# EAGLE design HBridge (EAGLE 6.6.0)
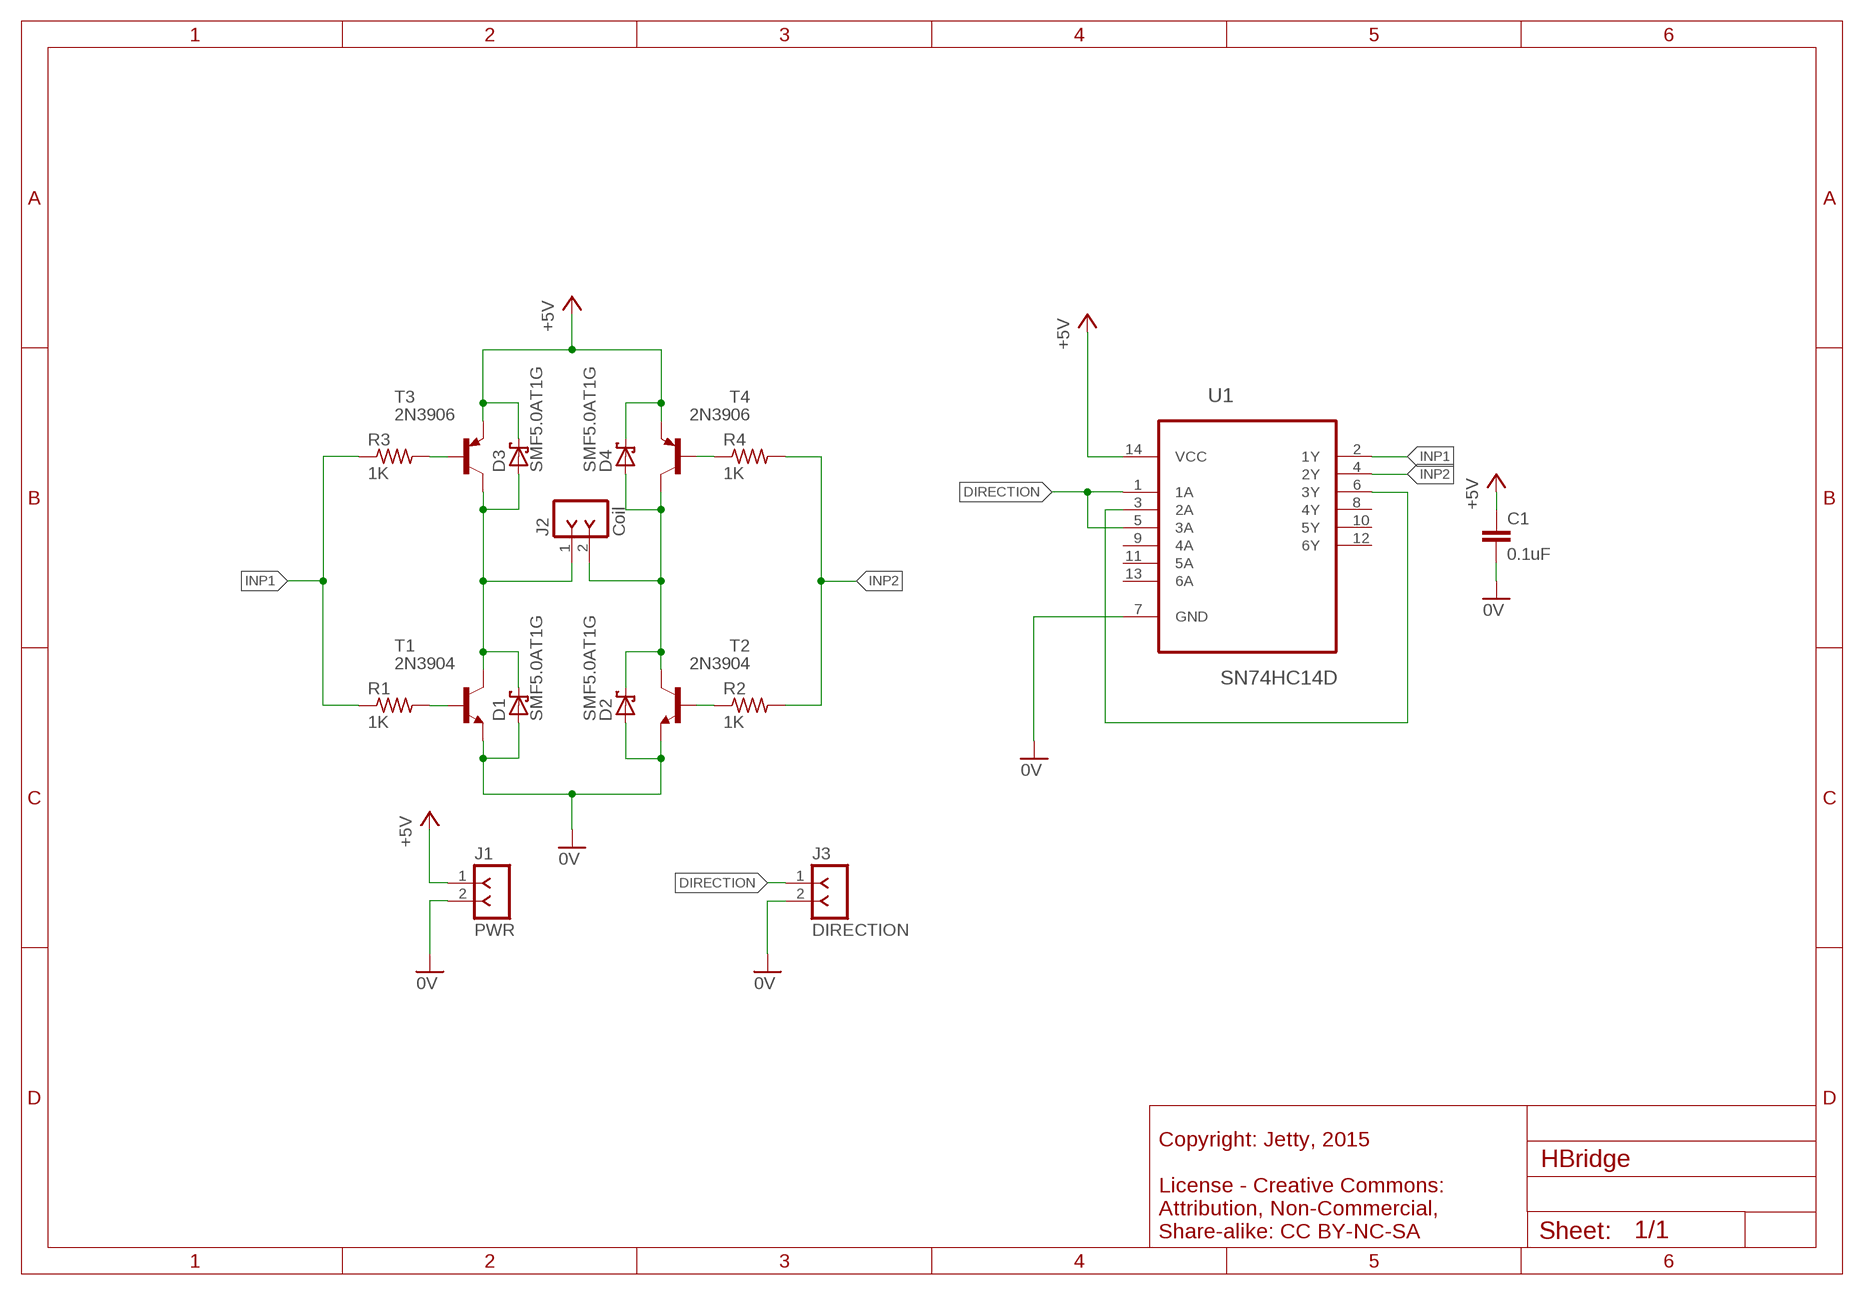
[diagram p0: schematic, sheet 1]

## Parts
C1  0.1uF  C-EUC0603  [C0603]
D1  SMF5.0AT1G  SMF5.0AT1  [SOD123FL]
D2  SMF5.0AT1G  SMF5.0AT1  [SOD123FL]
D3  SMF5.0AT1G  SMF5.0AT1  [SOD123FL]
D4  SMF5.0AT1G  SMF5.0AT1  [SOD123FL]
J1  PWR  F-1X02-SIP-100-32Y  [SIP-100-02-32Y]
J2  Coil  F-1X02-SIP-100-32Y  [SIP-100-02-32Y]
J3  DIRECTION  F-1X02-SIP-100-32Y  [SIP-100-02-32Y]
R1  1K  R-US_R0603  [R0603]
R2  1K  R-US_R0603  [R0603]
R3  1K  R-US_R0603  [R0603]
R4  1K  R-US_R0603  [R0603]
T1  2N3904  MMBT3904LT1-NPN-SOT23-BEC  [SOT23-BEC]
T2  2N3904  MMBT3904LT1-NPN-SOT23-BEC  [SOT23-BEC]
T3  2N3906  MMBT3906LT1-PNP-SOT23-BEC  [SOT23-BEC]
T4  2N3906  MMBT3906LT1-PNP-SOT23-BEC  [SOT23-BEC]
U1  SN74HC14D  [SOIC127P600X175-14N]

## Nets
0V: C1.2 D1.A D2.A J1.2 J3.2 T1.E T2.E U1.7(GND)
+5V: C1.1 D3.C D4.C J1.1 T3.E T4.E U1.14(VCC)
DIRECTION: J3.1 U1.1(1A) U1.5(3A)
INP1: R1.1 R3.1 U1.2(1Y)
INP2: R2.2 R4.2 U1.4(2Y)
N$1: R1.2 T1.B
N$2: R2.1 T2.B
N$3: R3.2 T3.B
N$4: R4.1 T4.B
N$6: D2.C D4.A J2.2 T2.C T4.C
N$7: D1.C D3.A J2.1 T1.C T3.C
N$10: U1.3(2A) U1.6(3Y)
Unconnected: U1.8(4Y) U1.9(4A) U1.10(5Y) U1.11(5A) U1.12(6Y) U1.13(6A)

## Notes on the sheet
- Copyright: Jetty, 2015
  
  License - Creative Commons:
  Attribution, Non-Commercial,
  Share-alike: CC BY-NC-SA

## Library data of the parts
C1 = rcl:C-EU: CAPACITOR, European symbol
D1-D4 = diode:SMF5.0AT1: 200 W Transient Voltage Suppressor Source: Data sheet <http://www.onsemi.com/pub_link/Collateral/SMF5.0AT1-D.PDF>
J1-J3 = con-headers-jp:F-1X02-: FEMALE HEADER
R1-R4 = rcl:R-US_: RESISTOR, American symbol
T1 T2 = transistor:*-NPN-: NPN Transistror BF959 corrected 2008.03.06
T3 T4 = transistor:*-PNP-: PNP Transistror
U1 = Texas Instruments_By_element14_Batch_1:SN74HC14D: HEX SCHMITT-TRIGGER INVERTERS; MPN: SN74HC14D; OC_FARNELL: 9594566; OC_NEWARK: 08F6449; PACKAGE: SOIC-14; SUPPLIER: Texas Instruments

## Board
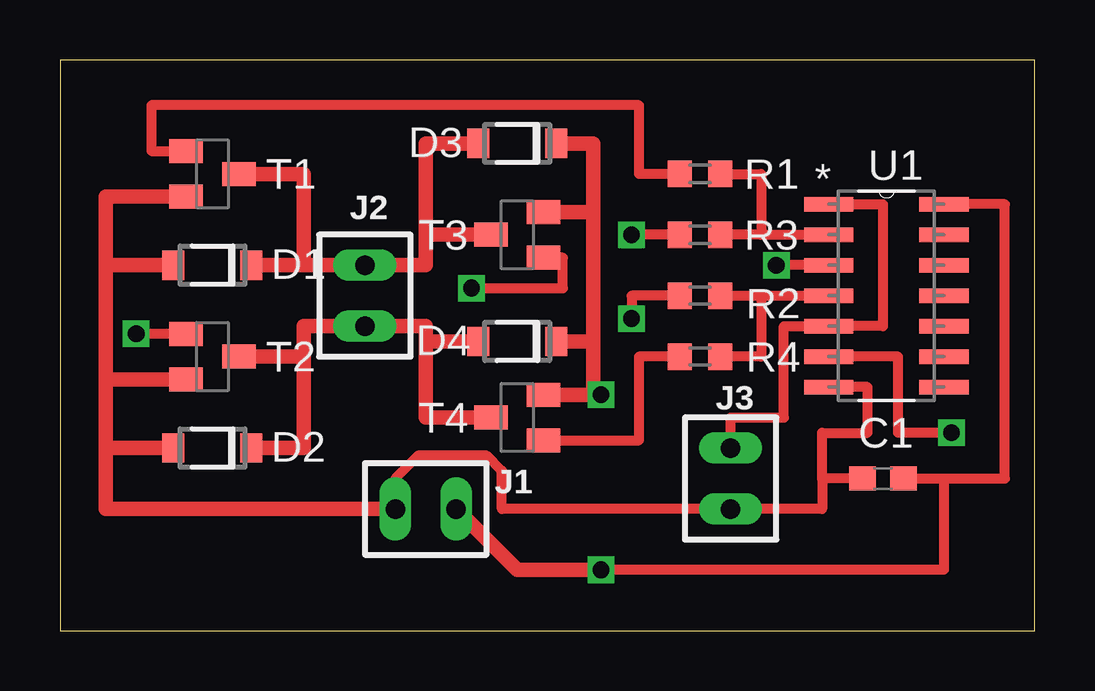
[diagram p1: board, top side]
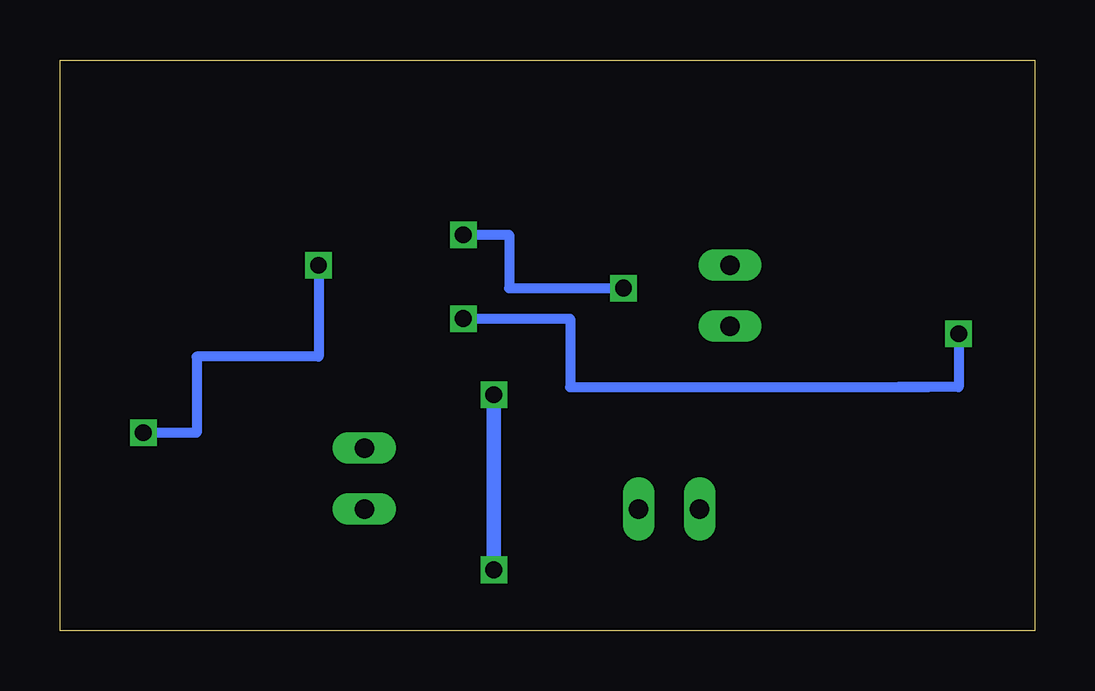
[diagram p2: board, bottom side, seen from below]

Size 40.62 x 23.8 mm. Coordinates in mm from the lower left corner, seen from the top.
Outline: 0,0 40.62,0 40.62,23.8 0,23.8 0,0
Copper layers (1*16): Top 0.035mm / dielectric 1.5mm / Bottom 0.035mm
Design rules "default": minimum track width 10mil, minimum drill 24mil, track to track 8mil, track to pad 8mil, pad to pad 8mil, via to via 8mil, smd to smd 8mil, copper to edge 40mil, drill to drill 8mil, minimum pad ring 10mil, minimum via ring 8mil, stop-mask expansion 4mil, vias tented up to drill 0mil, thermal gap 10mil

### Footprints (pad centres in the part's own frame; a part is rotated, then mirrored left to right if it is on the bottom)
C0603 = smd 1.1 x 1: 1 -0.85,0; 2 0.85,0
SOD123FL = smd 0.91 x 1.22: A 1.625,0; C -1.625,0
SIP-100-02-32Y = drill 0.813 long: 1 -1.27,0; 2 1.27,0
R0603 = smd 1 x 1.1: 1 -0.85,0; 2 0.85,0
SOT23-BEC = smd 1 x 1.4: B -0.95,-1.1; C 0,1.1; E 0.95,-1.1
SOIC127P600X175-14N = smd 2.057 x 0.61: 1 -4.801,7.62; 2 -4.801,6.35; 3 -4.801,5.08; 4 -4.801,3.81; 5 -4.801,2.54; 6 -4.801,1.27; 7 -4.801,0; 8 0,0; 9 0,1.27; 10 0,2.54; 11 0,3.81; 12 0,5.08; 13 0,6.35; 14 0,7.62

### Placement (x,y rotation side)
C1  34.29,6.35 180 top
D1  6.35,15.24 180 top
D2  6.35,7.62 180 top
D3  19.05,20.32 180 top
D4  19.05,12.06 180 top
J1  15.24,5.08 180 top
J2  12.7,13.97 270 top
J3  27.94,6.35 270 top
R1  26.67,19.05 180 top
R2  26.67,13.97 0 top
R3  26.67,16.51 180 top
R4  26.67,11.43 0 top
T1  6.35,19.05 270 top
T2  6.35,11.43 270 top
T3  19.05,16.51 90 top
T4  19.05,8.89 90 top
U1  36.83,10.16 0 top

### Tracks (layer width: path | path; a pad name or v marks a point on that pad's centre or on a via)
0V
  Top 0.406: C1.2 31.75,6.35 | 31.75,6.35 31.75,7.62 31.75,8.26 33.66,8.26 33.66,10.16 U1.7 | 31.75,6.35 31.75,5.08 J3.2 18.41,5.08 18.41,6.67 17.78,7.3 14.92,7.3 13.97,6.35 J1.2
  Top 0.61: 1.91,7.62 D2.A 1.91,7.62 | 1.91,7.62 1.91,9.84 | 1.91,9.84 1.91,10.48 | 1.91,10.48 T2.E | D1.A 1.91,15.24 | 1.91,15.24 1.91,17.78 1.91,18.1 T1.E | 1.91,15.24 1.91,10.48 | 1.91,10.48 1.91,9.84 | 1.91,7.62 1.91,5.08 J1.2
+5V  (via drill 0.7)
  Top 0.406: C1.1 36.83,6.35 | 36.83,6.35 39.37,6.35 39.37,17.78 U1.14 | C1.1 36.83,6.35 | C1.1 36.83,6.35 | 36.83,6.35 36.83,2.54 v22.54,2.54 19.05,2.54
  Top 0.61: D3.C 22.23,20.32 22.23,18.41 22.23,17.46 | T3.E 22.23,17.46 | D4.C 22.23,12.06 | 22.23,12.06 22.23,9.84 T4.E v22.54,9.84 | 22.23,17.46 22.23,12.06 | J1.1 19.05,2.54 v22.54,2.54
  Bottom 0.61: v22.54,9.84 v22.54,2.54
DIRECTION
  Top 0.406: J3.1 27.94,8.89 30.16,8.89 30.16,12.7 U1.5 34.29,12.7 34.29,17.78 U1.1
INP1
  Top 0.406: R1.1 29.21,19.05 29.21,16.51 | 29.21,16.51 R3.1 | 29.21,16.51 U1.2
INP2
  Top 0.406: R2.2 29.21,13.97 | 29.21,13.97 29.21,11.43 R4.2 | 29.21,13.97 U1.4
N$1
  Top 0.406: R1.2 24.13,19.05 24.13,21.91 3.81,21.91 3.81,20 T1.B
N$2  (via drill 0.7)
  Top 0.406: R2.1 23.81,13.97 v23.81,13.02 | T2.B v3.17,12.38
  Bottom 0.406: v23.81,13.02 19.37,13.02 19.37,10.16 5.71,10.16 | 5.71,10.16 4.45,10.16 | v3.17,12.38 3.17,10.16 5.71,10.16
N$3  (via drill 0.7)
  Top 0.406: R3.2 v23.81,16.51 | v17.14,14.29 20.95,14.29 20.95,15.56 T3.B
  Bottom 0.406: v23.81,16.51 22.86,16.51 21.91,16.51 21.91,14.29 v17.14,14.29
N$4
  Top 0.406: R4.1 24.13,11.43 24.13,7.94 T4.B
N$6
  Top 0.61: 15.24,12.7 J2.2 10.16,12.7 10.16,11.43 | 15.24,12.7 15.24,8.89 T4.C | T2.C 10.16,11.43 | D2.C 10.16,7.62 10.16,11.43 | D4.A 15.24,12.06 15.24,12.7
N$7
  Top 0.61: 15.24,16.51 15.24,15.24 J2.1 10.16,15.24 | 15.24,16.51 T3.C 15.24,16.51 | 10.16,15.24 10.16,19.05 T1.C | D1.C 10.16,15.24 | 15.24,16.51 15.24,20.32 D3.A
N$10  (via drill 0.7)
  Top 0.406: U1.3 v29.84,15.24 | v37.15,8.26 34.92,8.26 34.92,11.43 U1.6
  Bottom 0.406: v29.84,15.24 29.84,11.43 34.92,11.43 34.92,8.26 v37.15,8.26